# EAGLE schematic IrrigationControllerMaster (EAGLE 9.2.2)
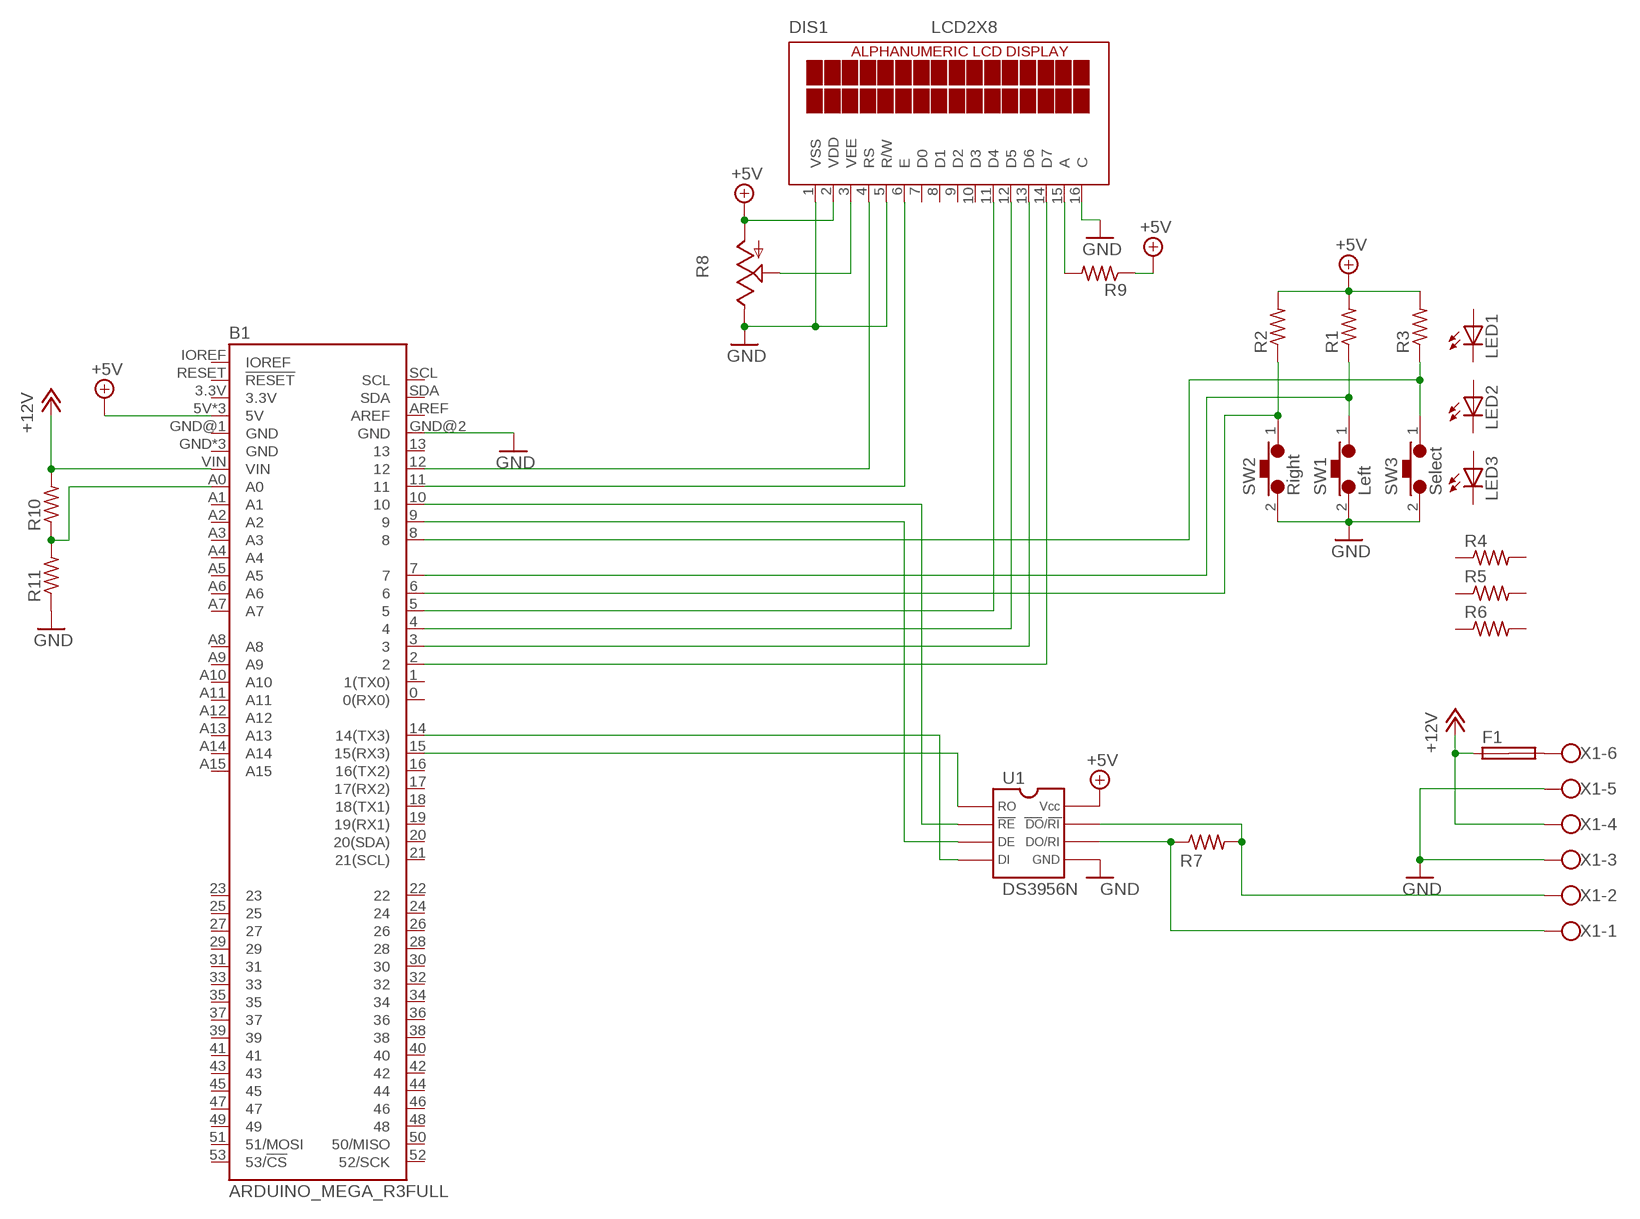
[diagram p0: schematic, sheet 1]

## Parts
B1  ARDUINO_MEGA_R3FULL  [ARDUINO_MEGA_NO_SILK]
DIS1  LCD2X8  [2X08_JAYCAR]
F1  SHK20L  [SHK20L]
LED1  LED5MM  [LED5MM]
LED2  LED5MM  [LED5MM]
LED3  LED5MM  [LED5MM]
R1  FLIPFLOP-RES  [0805-THM]
R2  FLIPFLOP-RES  [0805-THM]
R3  FLIPFLOP-RES  [0805-THM]
R4  FLIPFLOP-RES  [0805-THM]
R5  FLIPFLOP-RES  [0805-THM]
R6  FLIPFLOP-RES  [0805-THM]
R7  FLIPFLOP-RES  [0805-THM]
R8  TRIM_US-ECP10S  [ECP10S]
R9  FLIPFLOP-RES  [0805-THM]
R10  FLIPFLOP-RES  [0805-THM]
R11  FLIPFLOP-RES  [0805-THM]
SW1  Left  SPST_MOMENTARY  [2PIN]
SW2  Right  SPST_MOMENTARY  [2PIN]
SW3  Select  SPST_MOMENTARY  [2PIN]
U1  DS3956N  [DIL08]
X1  W237-6  [W237-6]

## Nets
+5V: B1.5V B1.5V@1(5V) B1.5V@2(5V) DIS1.2(VDD) R1.2 R2.2 R3.2 R8.A R9.1 U1.8(VCC)
+12V: B1.VIN F1.1A R10.2 X1.4
GND: B1.GND@2(GND) DIS1.1(VSS) DIS1.5(R/W) DIS1.16(C) R8.E R11.1 SW1.2 SW2.2 SW3.2 U1.5(GND) X1.3 X1.5
N$1: R7.2 U1.7(_DO/RI_) X1.2
N$2: R7.1 U1.6(DO/RI) X1.1
N$3: B1.7 R1.1 SW1.1
N$4: B1.6 R2.1 SW2.1
N$5: B1.8 R3.1 SW3.1
N$6: DIS1.3(VEE) R8.S
N$7: B1.12 DIS1.4(RS)
N$8: B1.11 DIS1.6(E)
N$9: B1.5 DIS1.11(D4)
N$10: B1.4 DIS1.12(D5)
N$11: B1.3 DIS1.13(D6)
N$12: B1.2 DIS1.14(D7)
N$13: B1.15(15(RX3)) U1.1(RO)
N$14: B1.14(14(TX3)) U1.4(DI)
N$15: B1.10 U1.2(_RE_)
N$16: B1.9 U1.3(DE)
N$17: DIS1.15(A) R9.2
N$18: B1.A0 R10.1 R11.2
N$19: F1.2A X1.6
Unconnected: B1.0(0(RX0)) B1.1(1(TX0)) B1.3.3V B1.13 B1.16(16(TX2)) B1.17(17(RX2)) B1.18(18(TX1)) B1.19(19(RX1)) B1.20(20(SDA)) B1.21(21(SCL)) B1.22 B1.23 B1.24 B1.25 B1.26 B1.27 B1.28 B1.29 B1.30 B1.31 B1.32 B1.33 B1.34 B1.35 B1.36 B1.37 B1.38 B1.39 B1.40 B1.41 B1.42 B1.43 B1.44 B1.45 B1.46 B1.47 B1.48 B1.49 B1.50(50/MISO) B1.51(51/MOSI) B1.52(52/SCK) B1.53(53/!CS) B1.A1 B1.A2 B1.A3 B1.A4 B1.A5 B1.A6 B1.A7 B1.A8 B1.A9 B1.A10 B1.A11 B1.A12 B1.A13 B1.A14 B1.A15 B1.AREF B1.GND B1.GND@1(GND) B1.GND@3(GND) B1.GND@4(GND) B1.IOREF B1.RESET(!RESET) B1.SCL B1.SDA DIS1.7(D0) DIS1.8(D1) DIS1.9(D2) DIS1.10(D3) F1.1B F1.2B LED1.A LED1.K(C) LED2.A LED2.K(C) LED3.A LED3.K(C) R4.1 R4.2 R5.1 R5.2 R6.1 R6.2

## Library data of the parts
B1 = SparkFun-Boards:ARDUINO_MEGA_R3: Arduino Mega R3 ATmega2560 R3 compatible footprint. SparkFun Products: Arduino Mega 2560 R3 <https://www.sparkfun.com/products/11061>
DIS1 = LCD_ConnectorOnly:LCD: Lcd footprint with only holes for the header in the footprint. Useful for mounting off board on flying leads. There is two packages available to suit both boards with a single row of pins and two rows.
F1 = fuse:SHK20L: FUSE HOLDER 5 x 20 mm, SH contact, SHH1 Schukat, E1073 Buerklin; OC_FARNELL: unknown; OC_NEWARK: unknown
LED1-LED3 = adafruit:LED: LED OSRAM: - CHIPLED LG R971, LG N971, LY N971, LG Q971, LY Q971, LO R971, LY R971 LH N974, LH R974 LS Q976, LO Q976, LY Q976 LO Q996 - Hyper CHIPLED LW Q18S LB Q993, LB Q99A, LB R99A - SideLED LS A670, LO A670, LY A670, LG A670, LP A670 LB A673, LV A673, LT A673, LW A673 LH A674 LY A675 LS A676, LA A676, LO A676, LY A676, LW A676 LS A679, LY A679, LG A679 - Hyper Micro SIDELED® LS Y876, LA Y876, LO Y876, LY Y876 LT Y87S - SmartLED LW L88C, LW L88S LB L89C, LB L89S, LG L890 LS L89K, LO L89K, LY L89K LS L896, LA L896, LO L896, LY L896 - TOPLED LS T670, LO T670, LY T670, LG T670, LP T670 LSG T670, LSP T670, LSY T670, LOP T670, LYG T670 LG T671, LOG T671, LSG T671 LB T673, LV T673, LT T673, LW T673 LH T674 LS T676, LA T676, LO T676, LY T676, LB T676, LH T676, LSB T676, LW T676 LB T67C, LV T67C, LT T67C, LS T67K, LO T67K, LY T67K, LW E67C LS E67B, LA E67B, LO E67B, LY E67B, LB E67C, LV E67C, LT E67C LW T67C LS T679, LY T679, LG T679 LS T770, LO T770, LY T770, LG T770, LP T770 LB T773, LV T773, LT T773, LW T773 LH T774 LS E675, LA E675, LY E675, LS T675 LS T776, LA T776, LO T776, LY T776, LB T776 LHGB T686 LT T68C, LB T68C - Hyper Mini TOPLED® LB M676 - Mini TOPLED Santana® LG M470 LS M47K, LO M47K, LY M47K Source: http://www.osram.convergy.de/
R1-R7 R9-R11 = adafruit:FLIPFLOP-RES: Flip Flop resistor An 0805 resistor inside a standard 1/4W 5% resistor. Makes for easy mods
R8 = pot:TRIM_US-: POTENTIOMETER
SW1-SW3 = OffBoardSwitches:SPST_MOMENTARY: A 2 pin 0.1" header with a button symbol for mounting buttons off board with the correct symbol in the schematic
U1 = DS3695N_RS485_Transceiver:DS3956N: DS35695N rs485 Transiever
X1 = con-wago-500:W237-6: WAGO SCREW CLAMP; OC_FARNELL: unknown; OC_NEWARK: unknown

## Net classes
0 default: clearance 0.205 mm